# Altium schematic sheet Hall_Effect.SchDoc
size A; SheetNumber: 9
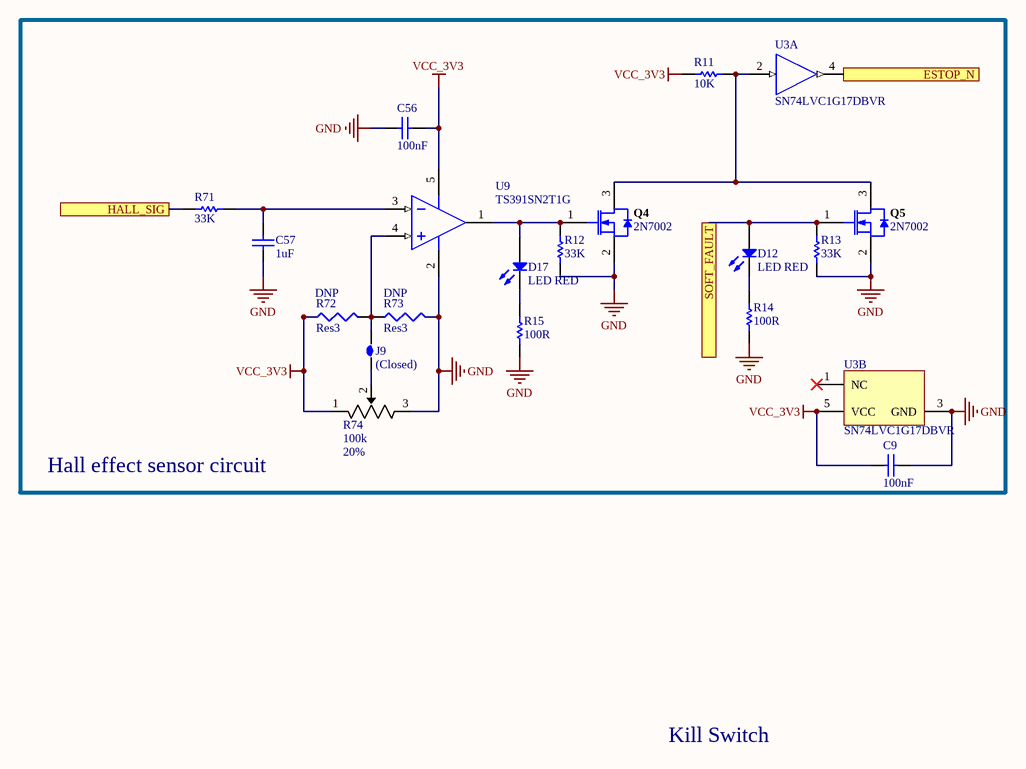
[diagram p0: Hall_Effect.SchDoc]

## Parts
C9  100nF  [CAPC0603(1608)100_N]
C56  100nF  [CAPC0603(1608)100_N]
C57  1uF  [CAPC0603(1608)100_N]
D12  LED RED  [LED_0805]
D17  LED RED  [LED_0805]
J9  (Closed)  [Solder Jumper - Closed]
Q4  2N7002  [INF-PG-SOT23_M]
Q5  2N7002  [INF-PG-SOT23_M]
R11  10K  [RESC0603(1608)_N]
R12  33K  [RESC0603(1608)_N]
R13  33K  [RESC0603(1608)_N]
R14  100R  [RESC0603(1608)_N]
R15  100R  [RESC0603(1608)_N]
R71  33K  [RESC0603(1608)_N]
R72  Res3  value DNP  [J1-0603]
R73  Res3  value DNP  [J1-0603]
R74  value 100k  Tolerance: 20%  [TT BI 22A TRIM POT]  (hidden comment: 22AR100KLFTR)
U3  SN74LVC1G17DBVR  [DBV0005A_M]  (parts A,B of 2)
U9  TS391SN2T1G  [ONSC-TSOP-5-483-02_V]

## Blocks framed on the sheet
Hall effect sensor circuit: C9 C56 C57 D12 D17 J9 Q4 Q5 R11-R15 R71-R74 U3 U9

## Ports
ESTOP_N, HALL_SIG, SOFT_FAULT

## Nets
GND: C9.1 C56.2 C57.1 Q4.2(SOURCE) Q5.2(SOURCE) R12.2 R13.2 R14.2 R15.2 R73.2 R74.3 U3.3(GND) U9.2(VEE)
VCC_3V3: C9.2 C56.1 R11.2 R72.1 R74.1 U3.5(VCC) U9.5(VCC)
ESTOP_N: U3.4(Y) ; port ESTOP_N
HALL_SIG: R71.1 ; port HALL_SIG
SOFT_FAULT: D12.2(A) Q5.1(GATE) R13.1 ; port SOFT_FAULT
NetC57_2: C57.2 R71.2 U9.3(IN-)
NetD12_1: D12.1(K) R14.1
NetD17_1: D17.1(K) R15.1
NetD17_2: D17.2(A) Q4.1(GATE) R12.1 U9.1(OUT)
NetJ9_1: J9.1 R74.2
NetJ9_2: J9.2 R72.2 R73.1 U9.4(IN+)
NetQ4_3: Q4.3(DRAIN) Q5.3(DRAIN) R11.1 U3.2(A)

Not connected (* = marked no-connect by the designer): U3 1(NC)*

## Notes on the sheet
- Kill Switch

## Library data of the parts
C9 C56 = CMP-1035-02580-1: CAP 100nF 10V ±10% 0603 (1608 Metric) Thickness 1mm SMD; Tolerance: Â±10%; Case-EIA: 0603; Case-Metric: 1608; Max Thickness: 1 mm; Value: 100nF; Rated Voltage: 10 V; Technology: SMT
C57 = CMP-1035-02733-1: CAP 1uF 10V ±10% 0603 (1608 Metric) Thickness 1mm SMD; Tolerance: Â±10%; Case-EIA: 0603; Case-Metric: 1608; Rated Voltage: 10 V; Max Thickness: 1 mm; Value: 1uF; Technology: SMT
D12 D17 = LED0: led; Manufacturer: Lite-On Inc.; Manufacturer Part Number: LTST-C171KRKT; Lens Color: Colorless; Lens Transparency: Clear; Millicandela Rating: 54mcd; Lens Style/Size: Rectangle with Flat Top, 1.40mm x 1.25mm; Voltage - Forward (Vf) (Typ): 2V; Current - Test: 20mA; Viewing Angle: 130°; Wavelength - Dominant: 631nm; Wavelength - Peak: 639nm; Supplier 1: Digi-Key; Supplier Part Number 1: 160-1427-1-ND; RoHS: RoHS Compliant; Category: Optoelectronics; Stock 1: 260544; Pricing 1: 1=0.31, 10=0.225, 25=0.1656, 100=0.1183, 250=0.0804, 500=0.07096, 1000=0.05558 (USD); Packaging: Cut Tape (CT); Part Status: Active; Color: Red; Mounting Type: Surface Mount; Features: -; Package / Case: 0805 (2012 Metric); Size / Dimension: 2.00mm L x 1.25mm W; Height (Max): 0.80mm; ComponentLink1URL: http://optoelectronics.liteon.com/upload/download/DS22-2000-109/LTST-C171KRKT.pdf; ComponentLink1Description: http://optoelectronics.liteon.com/upload/download/DS22-2000-109/LTST-C171KRKT.pdf
J9 = Jumper Closed: Jumper
Q4 Q5 = CMP-1149-00026-1: N-Channel OptiMOS Small-Signal-Transistor, 60 V VDS, 0.3 A ID, -55 to 150 degC, PG-SOT23, Reel, Green; Manufacturer: Infineon; RDS (on) (max) (@4.5V): 4,000 mOhm; VDS (max): 60 V; IDpuls (max): 1.2Â A; QG: 0.4Â nC; RDS (on) (max): 3,000 mOhm; RthJA (max): 250 K/W; ID (max): 0.3Â A; VGS(th) (max): 2.5Â V; VGS(th) (min): 1.5Â V; Green: TRUE; Ptot (max): 0.5Â W; PackageDescription: 3-Pin Small Outline Transistor Package, 2.9 x 1.3 mm Body, 0.95 mm Pitch; Halogen-free: TRUE; ComponentLink2Description: Datasheet; ComponentLink1URL: http://www.infineon.com/; Packing: Reel; DatasheetVersion: Rev. 2.4; PartNumber: 2N7002; PackageReference: PG-SOT23; PackageVersion: Apr-08; ComponentLink3URL: http://www.infineon.com/dgdl/SOT23-Package_Overview.pdf?folderId=db3a30431936bc4b0119532290053c66&fileId=db3a30431936bc4b0119533468123c85; ComponentLink1Description: Manufacturer URL; Mounting Technology: Surface Mount; ComponentLink3Description: Package Specification; ComponentLink2URL: http://www.infineon.com/dgdl/2N7002_Rev2.4.pdf?folderId=db3a3043156fd573011622e10b5c1f67&fileId=db3a304319bc939a0119c2a9461e79e6
R11 = CMP-1012-00098-1: 10K 0.1W 5% 0603 (1608 Metric)  SMD; Case-EIA: 0603; Value: 10000.00 Ohm; Case-Metric: 1608; Technology: SMT; Tolerance: 5 %; Power: 0.1 W
R12 R13 R71 = CMP-1012-00680-1: 33K 0.1W 1% 0603 (1608 Metric)  SMD; Case-EIA: 0603; Value: 33000.00 Ohm; Case-Metric: 1608; Tolerance: 1 %; Power: 0.1 W; Technology: SMT
R14 R15 = CMP-1012-00050-1: 100R 0.1W 5% 0603 (1608 Metric)  SMD; Case-EIA: 0603; Value: 100.00 Ohm; Case-Metric: 1608; Tolerance: 5 %; Technology: SMT; Power: 0.1 W
R72 R73 = Res3: Resistor; Published: 8-Jun-2000; LatestRevisionDate: 29-May-2009; LatestRevisionNote: IPC-7351 Footprint Added.; PackageReference: J1-0603; Publisher: Altium Limited; PackageDescription: Chip Resistor
R74 = TT 22AR Trim Pot: TT Electronics BI 22AR100KLFTR SMT trim pot, 100k 20%; Supplier 1: Digi-Key; Supplier Part Number 1: 987-1003-1-ND; Datasheet: http://www.bitechnologies.com/pdfs/22.pdf
U3 = CMP-0859-00033-1: Single Schmitt-Trigger Buffer, DBV0005A, LARGE T&R; Schmitt Trigger: Yes; Output Type: CMOS; Logic: True; F @ Nom Voltage(Max)(Mhz): 150; 3-State Output: No; VCC(Max)(V): 5.5; VCC(Min)(V): 1.65; tpd @ Nom Voltage(Max)(ns): 11,6.5,5.5,5; Voltage(Nom)(V): 1.8,2.5,3.3,5; Output Drive (IOL/IOH)(Max)(mA): 32/-32; Rating: Catalog; Sub-Family: Non-Inverting Buffer/Driver; Bits(#): 1; Technology Family: LVC; Input Type: CMOS/TTL; ICC @ Nom Voltage(Max)(mA): 0.01; Operating Temperature Range(C): -40 to 125,-40 to 85; ComponentLink2URL: http://www.ti.com/lit/ds/symlink/sn74lvc1g17.pdf; PackageReference: DBV0005A; PartNumber: SN74LVC1G17DBVR; Part Number: SN74LVC1G17; ComponentLink1URL: http://www.ti.com/; DatasheetVersion: SCES351V; ComponentLink1Description: Manufacturer URL; ComponentLink2Description: Datasheet
U9 = CMP-1305-00060-1: Low Power Single Voltage Comparator, 2 to 36 V, -40 to 125 degC, 5-Pin TSOP, Pb-Free, Tape and Reel; Manufacturer: On Semiconductor; VCC Min (V): 2; VCC Max (V): 36; ICC Typ (mA): 0.5; IO Typ (mA): 16; DatasheetVersion: Rev. 3; Mounting Technology: Surface Mount; PackageVersion: Rev. K, 04/2013; ComponentLink2Description: Datasheet; ComponentLink3Description: Package Specification; ComponentLink3URL: http://www.onsemi.com/pub_link/Collateral/483.PDF; ComponentLink2URL: http://www.onsemi.com/pub_link/Collateral/TS391-D.PDF; Packing: Tape and Reel; ComponentLink1Description: Manufacturer URL; ComponentLink1URL: http://www.onsemi.com/; PackageReference: TSOP-5-483-02; PackageDescription: 5-Pin Small Outline Package, Body 3 x 1.5 mm, Pitch 0.95 mm; PartNumber: TS391SN2T1G; RoHS: TRUE